# Altium schematic sheet SCH_V1.0.SchDoc
size A2; SheetNumber: 1; SheetTotal: 1
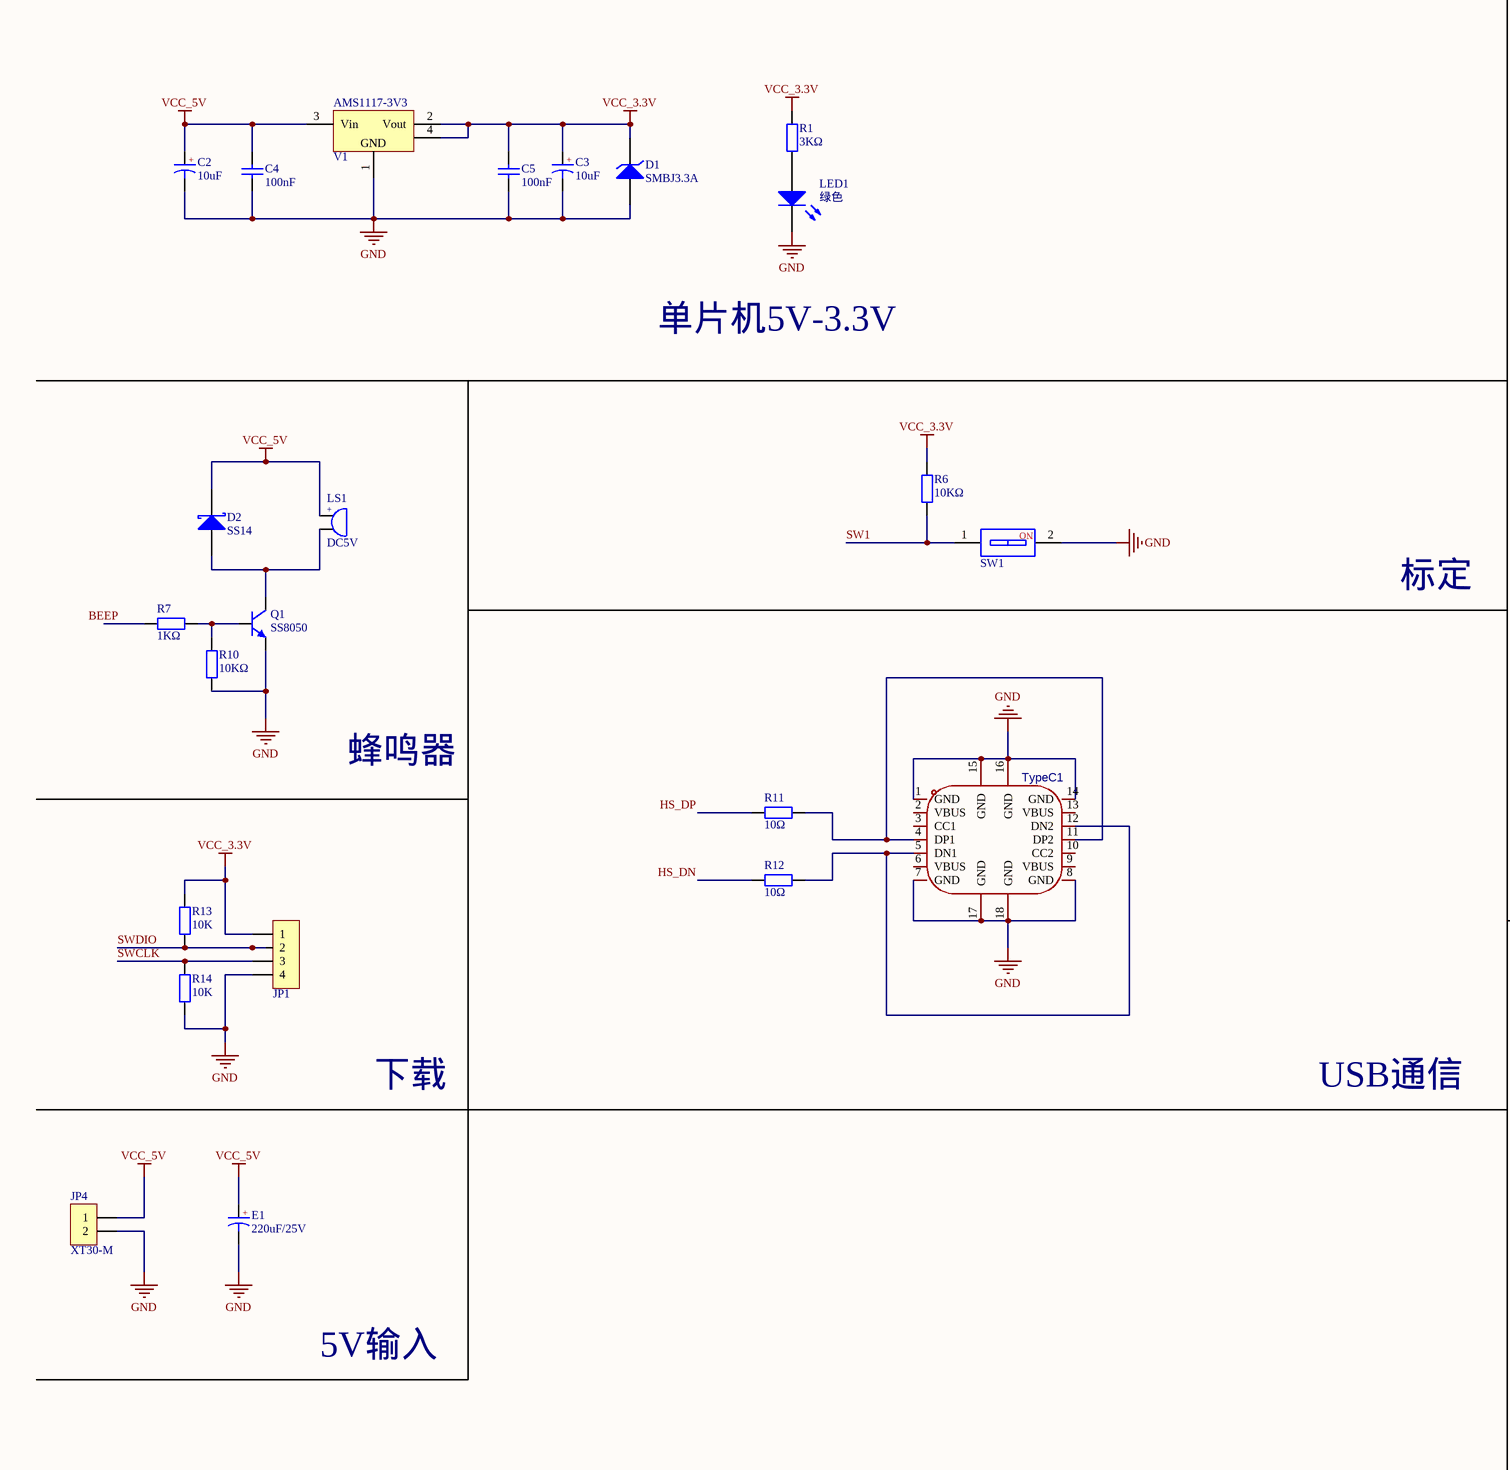
[diagram p0: SCH_V1.0.SchDoc, left]
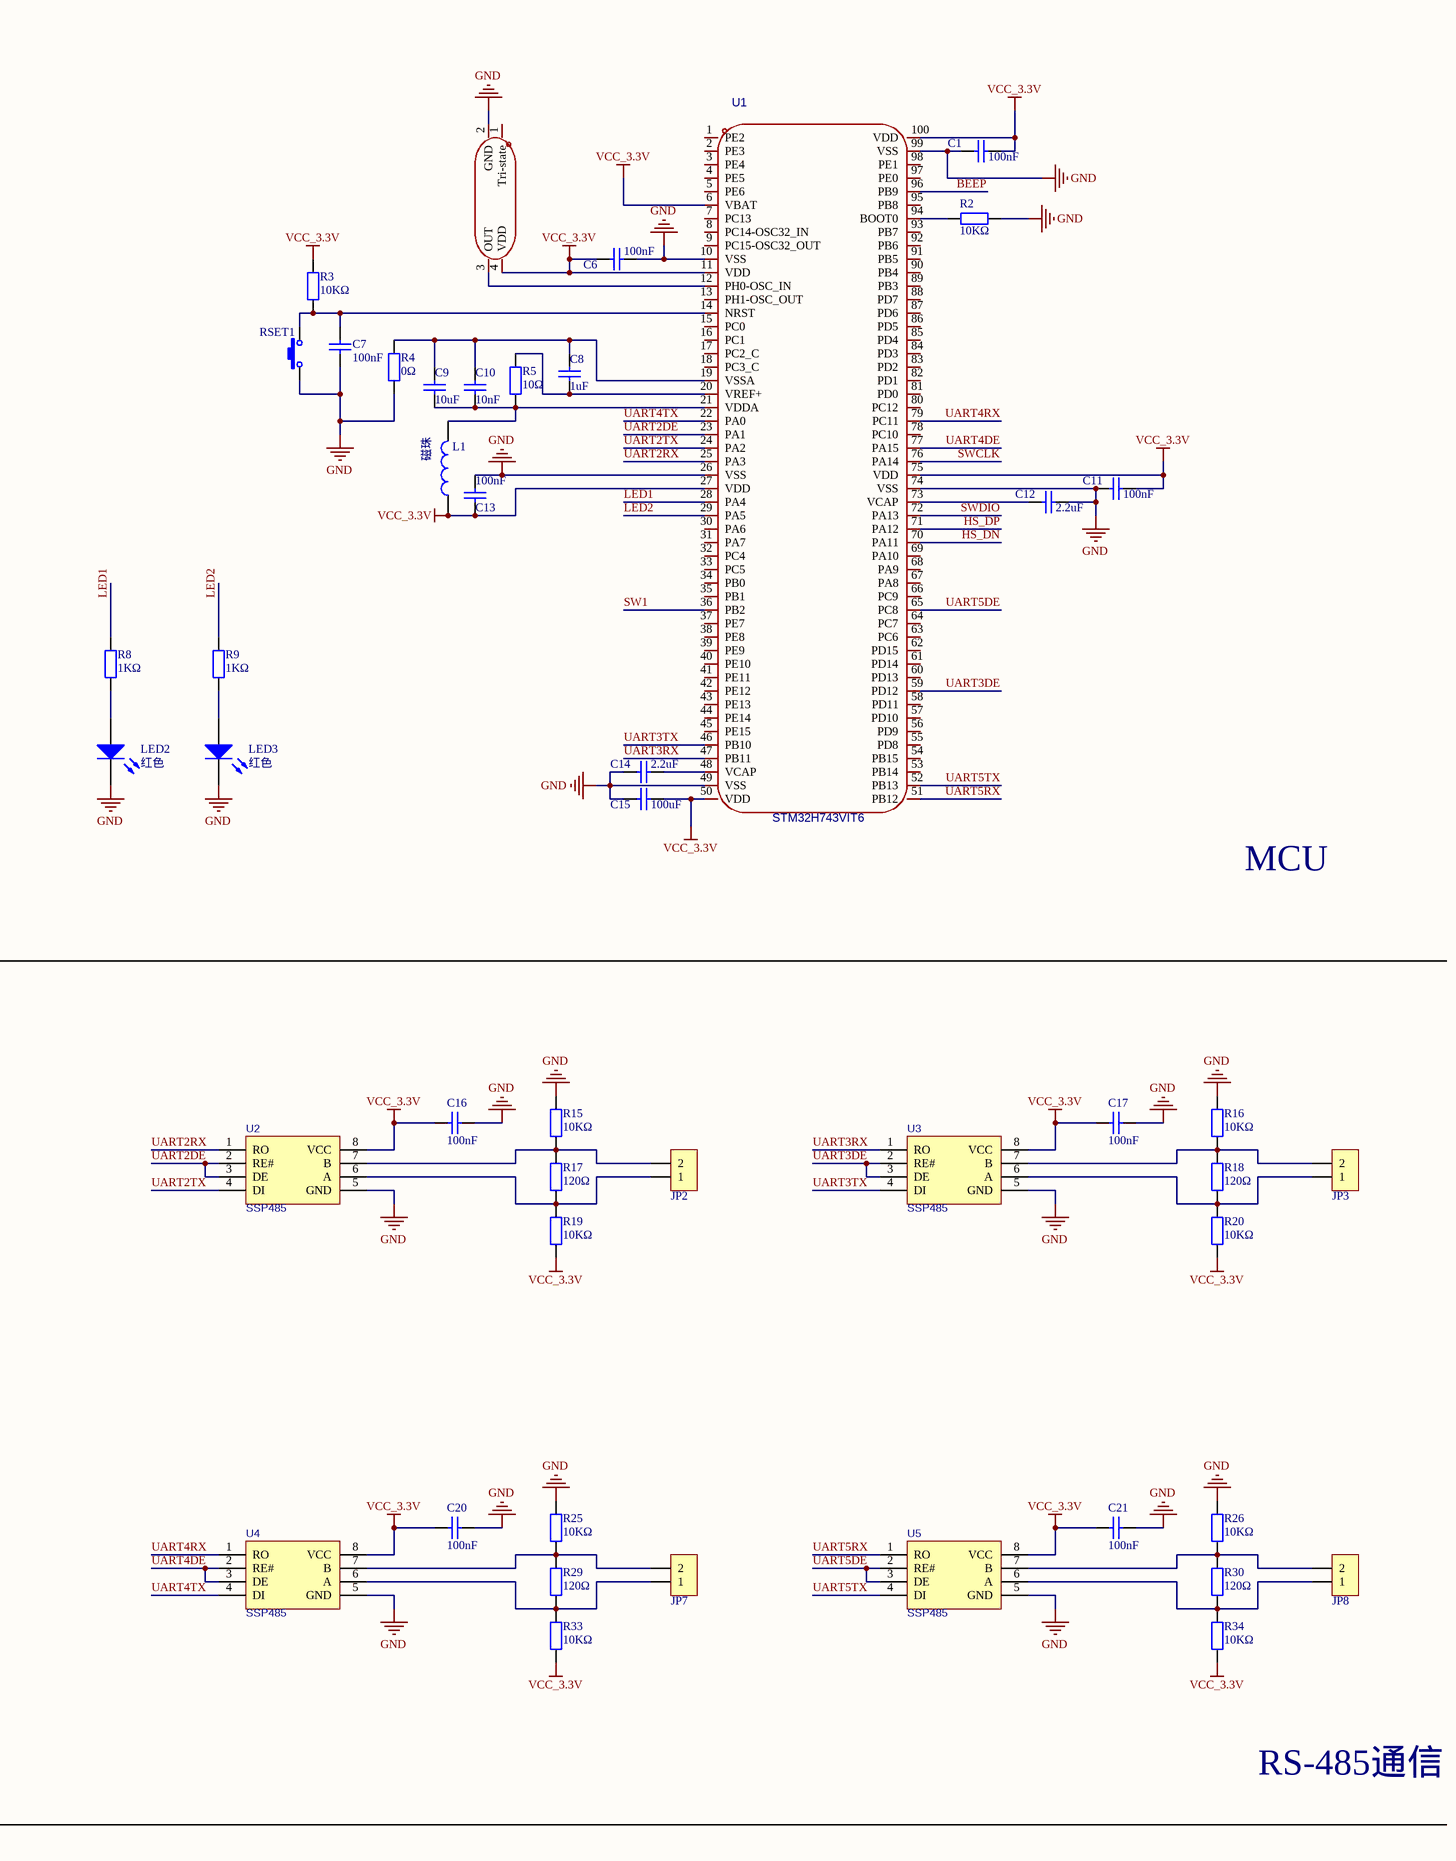
[diagram p1: SCH_V1.0.SchDoc, right]

## Parts
C1  100nF  [C0603_L]
C2  10uF  [C_3216]
C3  10uF  [C_3216]
C4  100nF  [C1206_L]
C5  100nF  [C1206_L]
C6  100nF  [C0603_L]
C7  100nF  [C0603_L]
C8  1uF  [C0603_L]
C9  10uF  [C0603_L]
C10  10nF  [C0603_L]
C11  100nF  [C0603_L]
C12  2.2uF  [C0603_L]
C13  100nF  [C0603_L]
C14  2.2uF  [C0603_L]
C15  100uF  [C0603_L]
C16  100nF  [C0603_L]
C17  100nF  [C0603_L]
C20  100nF  [C0603_L]
C21  100nF  [C0603_L]
D1  SMBJ3.3A  [SMB]
D2  SS14  [SMA]
E1  220uF/25V  [CS 6*6 - B]
JP1  HDR-1X4  [XH2.54-W-4P]  (value not drawn)
JP2  HDR-1X2  [XH2.54-W-2P]  (value not drawn)
JP3  HDR-1X2  [XH2.54-W-2P]  (value not drawn)
JP4  XT30-M  [XT30PW-M]
JP7  HDR-1X2  [XH2.54-W-2P]  (value not drawn)
JP8  HDR-1X2  [XH2.54-W-2P]  (value not drawn)
L1  磁珠  [L0603]
LED1  绿色  [LED0603_B]
LED2  红色  [LED0603_G]
LED3  红色  [LED0603_R]
LS1  DC5V  [BEEP 5x9x5.5]
OSC1  8MHz  [XTAL-3225-4P]  (value not drawn)
Q1  SS8050  [SOT23-3N]
R1  3KΩ  [R0603_L]
R2  10KΩ  [R0603_L]
R3  10KΩ  [R0603_L]
R4  0Ω  [R0603_L]
R5  10Ω  [R0603_L]
R6  10KΩ  [R0603_L]
R7  1KΩ  [R0603_L]
R8  1KΩ  [R0603_L]
R9  1KΩ  [R0603_L]
R10  10KΩ  [R0603_L]
R11  10Ω  [R0603_L]
R12  10Ω  [R0603_L]
R13  10K  [R0603_L]
R14  10K  [R0603_L]
R15  10KΩ  [R0603_L]
R16  10KΩ  [R0603_L]
R17  120Ω  [R0603_L]
R18  120Ω  [R0603_L]
R19  10KΩ  [R0603_L]
R20  10KΩ  [R0603_L]
R25  10KΩ  [R0603_L]
R26  10KΩ  [R0603_L]
R29  120Ω  [R0603_L]
R30  120Ω  [R0603_L]
R33  10KΩ  [R0603_L]
R34  10KΩ  [R0603_L]
RSET1  3x6x5  [SW SMD-3*6*2.5]  (value not drawn)
SW1  DIP-SW-1P  [SW DIP-1P]  (value not drawn)
TypeC1  U264-141N-4BAC10  [USB-C-Type-侧插]  (value not drawn)
U1  STM32H743VIT6  [LQFP-100_L14.0-W14.0-P0.50-LS16.0-BL]
U2  SSP485  [SOP-8]
U3  SSP485  [SOP-8]
U4  SSP485  [SOP-8]
U5  SSP485  [SOP-8]
V1  AMS1117-3V3  [SOT223_L]

## Nets
GND: C1.1 C2.2(K) C3.2(K) C4.1 C5.1 C6.2 C7.1 C11.1 C12.2 C13.1 C14.1 C15.1 C16.2 C17.2 C20.2 C21.2 D1.1(A) E1.2 JP1.4 JP4.2 LED1.2(K) LED2.2(K) LED3.2(K) OSC1.2(GND) Q1.2(E) R2.2 R4.1 R10.2 R14.1 R15.2 R16.2 R25.2 R26.2 RSET1.1 SW1.2 TypeC1.1(GND) TypeC1.7(GND) TypeC1.8(GND) TypeC1.14(GND) TypeC1.15(GND) TypeC1.16(GND) TypeC1.17(GND) TypeC1.18(GND) U1.10(VSS) U1.26(VSS) U1.49(VSS) U1.74(VSS) U1.99(VSS) U2.5(GND) U3.5(GND) U4.5(GND) U5.5(GND) V1.1(GND)
VCC_3.3V: C1.2 C3.1(A) C5.2 C6.1 C11.2 C13.2 C15.2 C16.1 C17.1 C20.1 C21.1 D1.2(K) JP1.1 L1.1 OSC1.4(VDD) R1.1 R3.2 R6.2 R13.2 R19.1 R20.1 R33.1 R34.1 U1.6(VBAT) U1.11(VDD) U1.27(VDD) U1.50(VDD) U1.75(VDD) U1.100(VDD) U2.8(VCC) U3.8(VCC) U4.8(VCC) U5.8(VCC) V1.2(Vout) V1.4(OUT)
VCC_5V: C2.1(A) C4.2 D2.2(K) E1.1 JP4.1 LS1.1 V1.3(Vin)
BEEP: R7.1 U1.96(PB9)
HS_DN: R12.1 U1.70(PA11)
HS_DP: R11.1 U1.71(PA12)
LED1: R8.2 U1.28(PA4)
LED2: R9.2 U1.29(PA5)
SW1: R6.1 SW1.1 U1.36(PB2)
SWCLK: JP1.3 R14.2 U1.76(PA14)
SWDIO: JP1.2 R13.1 U1.72(PA13)
UART2DE: U1.23(PA1) U2.2(RE#) U2.3(DE)
UART2RX: U1.25(PA3) U2.1(RO)
UART2TX: U1.24(PA2) U2.4(DI)
UART3DE: U1.59(PD12) U3.2(RE#) U3.3(DE)
UART3RX: U1.47(PB11) U3.1(RO)
UART3TX: U1.46(PB10) U3.4(DI)
UART4DE: U1.77(PA15) U4.2(RE#) U4.3(DE)
UART4RX: U1.79(PC11) U4.1(RO)
UART4TX: U1.22(PA0) U4.4(DI)
UART5DE: U1.65(PC8) U5.2(RE#) U5.3(DE)
UART5RX: U1.51(PB12) U5.1(RO)
UART5TX: U1.52(PB13) U5.4(DI)
NetC7_2: C7.2 R3.1 RSET1.2 U1.14(NRST)
NetC8_1: C8.1 R5.2 U1.20(VREF+)
NetC8_2: C8.2 C9.1 C10.2 R4.2 U1.19(VSSA)
NetC9_2: C9.2 C10.1 L1.2 R5.1 U1.21(VDDA)
NetC12_1: C12.1 U1.73(VCAP)
NetC14_2: C14.2 U1.48(VCAP)
NetD2_1: D2.1(A) LS1.2 Q1.3(C)
NetJP2_1: JP2.1 R17.1 R19.2 U2.6(A)
NetJP2_2: JP2.2 R15.1 R17.2 U2.7(B)
NetJP3_1: JP3.1 R18.1 R20.2 U3.6(A)
NetJP3_2: JP3.2 R16.1 R18.2 U3.7(B)
NetJP7_1: JP7.1 R29.1 R33.2 U4.6(A)
NetJP7_2: JP7.2 R25.1 R29.2 U4.7(B)
NetJP8_1: JP8.1 R30.1 R34.2 U5.6(A)
NetJP8_2: JP8.2 R26.1 R30.2 U5.7(B)
NetLED1_1: LED1.1(A) R1.2
NetLED2_1: LED2.1(A) R8.1
NetLED3_1: LED3.1(A) R9.1
NetOSC1_3: OSC1.3(OUT) U1.12(PH0-OSC_IN)
NetQ1_1: Q1.1(B) R7.2 R10.1
NetR2_1: R2.1 U1.94(BOOT0)
NetR11_2: R11.2 TypeC1.4(DP1) TypeC1.11(DP2)
NetR12_2: R12.2 TypeC1.5(DN1) TypeC1.12(DN2)

Not connected (* = marked no-connect by the designer): OSC1 1(Tri-state); TypeC1 2(VBUS) 3(CC1) 6(VBUS) 9(VBUS) 10(CC2) 13(VBUS); U1 1(PE2) 2(PE3) 3(PE4) 4(PE5) 5(PE6) 7(PC13) 8(PC14-OSC32_IN) 9(PC15-OSC32_OUT) 13(PH1-OSC_OUT) 15(PC0) 16(PC1) 17(PC2_C) 18(PC3_C) 30(PA6) 31(PA7) 32(PC4) 33(PC5) 34(PB0) 35(PB1) 37(PE7) 38(PE8) 39(PE9) 40(PE10) 41(PE11) 42(PE12) 43(PE13) 44(PE14) 45(PE15) 53(PB14) 54(PB15) 55(PD8) 56(PD9) 57(PD10) 58(PD11) 60(PD13) 61(PD14) 62(PD15) 63(PC6) 64(PC7) 66(PC9) 67(PA8) 68(PA9) 69(PA10) 78(PC10) 80(PC12) 81(PD0) 82(PD1) 83(PD2) 84(PD3) 85(PD4) 86(PD5) 87(PD6) 88(PD7) 89(PB3) 90(PB4) 91(PB5) 92(PB6) 93(PB7) 95(PB8) 97(PE0) 98(PE1)

## Notes on the sheet
- 单片机5V-3.3V
- 标定
- 蜂鸣器
- MCU
- 下载
- USB通信
- 5V输入
- RS-485通信
- (in symbol BEEP) +
- (in symbol CS_SMD) +
- (in symbol CT) +
- (in symbol DIP-SW-1P) NO

## Library data of the parts
C1 C4-C15 = C: 贴片电容/MLCC电容; BOM名称: 无极性贴片电容; 联系下单店铺卖家 免费帮你查找封装: 联系下单店铺卖家 免费技术指导
C2 C3 = CT: 贴片钽电容; 联系下单店铺卖家 免费帮你查找封装: 联系下单店铺卖家 免费技术指导; BOM名称: 贴片钽电容
C16 C17 C20 C21 = CC: 瓷片电容; BOM名称: 直插瓷片电容; 当前库版本V2024.8.30，下一版本发布时间2024年10月份 @淘宝卖家:黄晶宝石: 最新版本发布网址https://item.taobao.com/item.htm?id=566775463719
D1 = SMBJ30A-E3/52: 30V 600W瞬态抑制二极管; BOM名称: TVS瞬态抑制二极管; 当前库版本V2024.8.30，下一版本发布时间2024年10月份 @淘宝卖家:黄晶宝石: 最新版本发布网址https://item.taobao.com/item.htm?id=566775463719; 属性: 30V 600W
D2 = SS14: 肖特基二极管; 属性: 40V/1A; 当前库版本V2024.8.30，下一版本发布时间2024年10月份 @淘宝卖家:黄晶宝石: 最新版本发布网址https://item.taobao.com/item.htm?id=566775463719; BOM名称: 肖特基二极管
E1 = CS_SMD: 贴片固态电容; 联系下单店铺卖家 免费帮你查找封装: 联系下单店铺卖家 免费技术指导; BOM名称: 贴片固态电容
JP1 = Header 4: 4P接插件; 联系卖家，免费查找封装: 唯一出售店铺网址https://shop463601444.taobao.com; 封装库来自淘宝卖家ID：黄晶宝石: 其他店铺购入均为盗版封装库，请立即申请退款，本店现金奖励50~200元; BOM名称: 4P接插件
JP2 JP3 JP7 JP8 = Header 2: 2P接插件; 联系卖家，免费查找封装: 唯一出售店铺网址https://shop463601444.taobao.com; 封装库来自淘宝卖家ID：黄晶宝石: 其他店铺购入均为盗版封装库，请立即申请退款，本店现金奖励50~200元; BOM名称: 2P接插件
JP4 = XT30-M: XT30公头; 当前库版本V2024.5.31，下一版本发布时间2024年8月份 @淘宝卖家:黄晶宝石: 最新版本发布网址https://item.taobao.com/item.htm?id=566775463719
L1 = L: 贴片小功率电感; BOM名称: 小功率贴片电感; 联系下单店铺卖家 免费帮你查找封装: 联系下单店铺卖家 免费技术指导
LED1-LED3 = LED: 贴片LED; 封装库来自淘宝卖家：黄晶宝石: 其他店铺购入均为盗版封装库，无更新权益，请立即申请退款，本店现金奖励200~1000元; BOM名称: 贴片LED
LS1 = BEEP: 蜂鸣器; 联系下单店铺卖家 免费技术支持: 联系下单店铺卖家 免费帮你查找封装; BOM名称: 蜂鸣器
OSC1 = XTAL-OT2EL4C4JI: Manufacturer: YXC(扬兴晶振); Symbol: OT2EL4C4JI-111OLP-8M; Add into BOM: yes; Normal temperature Frequency Tolerance: ±10ppm; Output Type: CMOS; Supply Voltage: 1.8V~3.3V; Device: OT2EL4C4JI-111OLP-8M; LCSC Part Name: 8MHZ?1.8V-3.3V?±10PPM YSO110TR; Supplier Part: C5189450; Manufacturer Part: OT2EL4C4JI-111OLP-8M; Supplier Footprint: SMD3225-4P; JLCPCB Part Class: Extended Part; Datasheet: https://atta.szlcsc.com/upload/public/pdf/source/20221009/1148DEA51132416CC556CBB25766F9C8.pdf; Supplier: LCSC; Convert to PCB: yes; Value: 8MHz; Operating Temperature: -40℃~+85℃
Q1 = 8050-SMD: 高频放大-NPN型; 参数: 40V 1.5A 1W 100MHZ; 当前库版本V2024.8.30，下一版本发布时间2024年10月份 @淘宝卖家:黄晶宝石: 最新版本发布网址https://item.taobao.com/item.htm?id=566775463719; BOM名称: 高频放大-NPN型
R1-R20 R25 R26 R29 R30 R33 R34 = R: 贴片电阻; 联系下单店铺卖家 免费帮你查找封装: 联系下单店铺卖家 免费技术指导; BOM名称: 贴片电阻
RSET1 = SW-PB: 微动开关; BOM名称: 3x6轻触开关; 联系下单店铺卖家 免费技术支持: 联系下单店铺卖家 免费帮你查找封装
SW1 = DIP-SW-1P: 1路拨码开关; 联系下单店铺卖家 免费技术支持: 联系下单店铺卖家 免费帮你查找封装; BOM名称: 1路拨码开关
TypeC1 = USB3.0-Type-C-侧插: Manufacturer: XKB Connectivity(中国星坤); Add into BOM: yes; Connector Type: Type-C; Gender: 母; Number of Ports: 1; Number of Contacts: 14P; Current Rating - Power (Max): 3A; Soldering Temperature(Max): 235℃; Symbol: U264-141N-4BAC10; Device: U264-141N-4BAC10; LCSC Part Name: Type-C 母 侧插; Supplier Part: C692526; Manufacturer Part: U264-141N-4BAC10; Supplier Footprint: 插件; JLCPCB Part Class: Extended Part; Datasheet: https://atta.szlcsc.com/upload/public/pdf/source/20211011/3C526B1D157DB714A375BD92771BEA39.pdf; Supplier: LCSC; Convert to PCB: yes; Standard: USB 3.1; Mounting Style: 侧插; Contact Material: 铜合金; Contact Plating: 金; Operating Temperature Range: -40℃~+85℃
U1 = STM32H743VIT6_C114409: Manufacturer: ST(意法半导体); Add into BOM: yes; Program Storage Size: 2MB; GPIO Ports Number: 82; Operating Voltage Range: 1.71V~3.6V; CPU Maximum Speed: 480MHz; ADC (Bit): 16bit; DAC (Bit): 12bit; Universal Serial Bus: 有; Symbol: stm32h743vit6_c114409; Device: STM32H743VIT6_C114409; LCSC Part Name: 带DSP和DP-FPU的高性能ARM Cortex-M7 MCU，具有2 MB Flash、1 MB RAM、480 MHz CPU、ART加速器、一级缓存、外部存储器接口和大量外设; Supplier Part: C114409; Manufacturer Part: STM32H743VIT6; Supplier Footprint: LQFP-100(14x14); JLCPCB Part Class: Extended Part; Datasheet: https://atta.szlcsc.com/upload/public/pdf/source/20200508/C529058_DA70143F266D6D825C3A912656F12A87.pdf; Supplier: LCSC; Convert to PCB: yes; CPU Core: -; Operating Temperature Range: -40℃~+85℃; Watchdog: 有; Infrared Data Association: 有; Low-Voltage Detect: 有; LCD Module: 有; Secure Digital Input and Output: 有; Direct Memory Access: 有; Internal Oscillator: 有
U2-U5 = MAX3485CSA: RS485/RS422收发器芯片; 当前库版本V2024.8.30，下一版本发布时间2024年10月份 @淘宝卖家:黄晶宝石: 最新版本发布网址https://item.taobao.com/item.htm?id=566775463719
V1 = AMS1117: 三端稳压芯片; BOM名称: 稳压芯片; 联系下单店铺卖家 免费帮你查找封装: 联系下单店铺卖家 免费技术支持; 当前库版本V2024.8.30，下一版本发布时间2024年10月份 @淘宝卖家:黄晶宝石: 最新版本发布网址https://item.taobao.com/item.htm?id=566775463719